# Altium project Proco RAT.PrjPcb
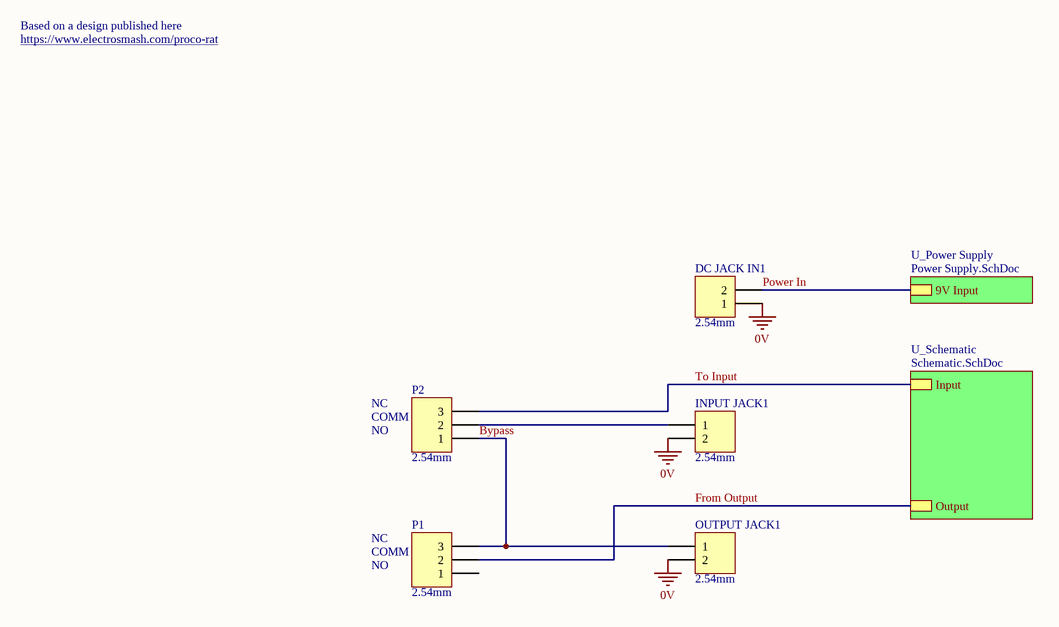
[diagram p0: Top Level.SchDoc]
2 sheets, 16 parts. Net scope: hierarchical (ports join the sheet entries above them; power ports are global).
Board file: PCB.PcbDoc
Sheets:
  Top Level.SchDoc
    U_Power Supply = Power Supply.SchDoc

## Sheet Top Level.SchDoc
size A4

### Parts
DC_JACK_IN1  2.54mm  [TH 2.54mm Header 1x2]
INPUT_JACK1  2.54mm  [TH 2.54mm Header 1x2]
OUTPUT_JACK1  2.54mm  [TH 2.54mm Header 1x2]
P1  2.54mm  [TH 2.54mm Header 1x3]
P2  2.54mm  [TH 2.54mm Header 1x3]

### Sub-sheets
U_Power Supply = Power Supply.SchDoc: 9V Input
U_Schematic = Schematic.SchDoc (file not in this document): Output, Input

### Nets
0V: DC_JACK_IN1.1 INPUT_JACK1.2 OUTPUT_JACK1.2
Bypass: OUTPUT_JACK1.1 P1.3 P2.1
From Output: P1.2 ; sheet U_Schematic/Output
Power In: DC_JACK_IN1.2 ; sheet U_Power Supply/9V Input
To Input: P2.3 ; sheet U_Schematic/Input
NetINPUT_JACK1_1: INPUT_JACK1.1 P2.2

Not connected (* = marked no-connect by the designer): P1 1

### Notes on the sheet
- https://www.electrosmash.com/proco-rat
- Based on a design published here
- NC
- COMM
- NO

### Library data of the parts
DC_JACK_IN1 INPUT_JACK1 OUTPUT_JACK1 = TH 2.54mm Header 1x2: Positions: 2; Angle: 0; Flange: No; Contact: NA; Part Number: TH 2.54mm Header 1x2; Pitch: 2.54mm; Row Spacing: 2.54mm
P1 P2 = TH 2.54mm Header 1x3: Positions: 3; Angle: 0; Flange: No; Contact: NA; Part Number: TH 2.54mm Header 1x3; Pitch: 2.54mm; Row Spacing: 2.54mm

## Sheet Power Supply.SchDoc
size A4
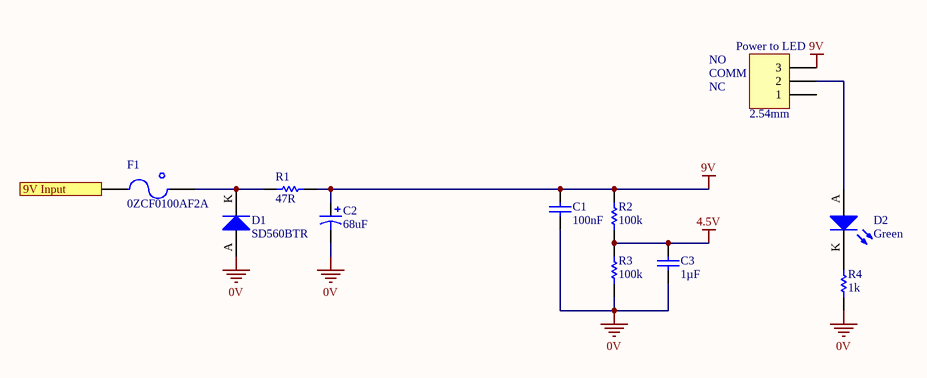
[diagram p1: Power Supply.SchDoc]

### Parts
C1  100nF  [0805]
C2  68uF  [2924]
C3  1µF  [0805]
D1  SD560BTR  [SMB Diode]
D2  Green  [5MM LED]
F1  0ZCF0100AF2A  [2920]
Power_to_LED  2.54mm  [TH 2.54mm Header 1x3]
R1  47R  [2512]
R2  100k  [0805]
R3  100k  [0805]
R4  1k  [0805]

### Ports
9V Input

### Nets
0V: C1.2 C2.1 C3.1 D1.A R3.1 R4.1
4.5V: C3.2 R2.1 R3.2
9V: C1.1 C2.2 Power_to_LED.3 R1.2 R2.2
Power In: F1.1 ; port 9V Input
NetD1_K: D1.K F1.2 R1.1
NetD2_A: D2.A Power_to_LED.2
NetD2_K: D2.K R4.2

Not connected (* = marked no-connect by the designer): Power_to_LED 1

### Notes on the sheet
- NC
- COMM
- NO

### Library data of the parts
C1 = GCM21BR71H104KA37L: Manufacturer: muRata; Tolerance: ±10%; Material: X7R; Rated Voltage: 50V; Part Number: GCM21BR71H104KA37L; Value: 100nF; Digikey Part Number: 490-6064-1-ND
C2 = TAJV686K035RNJ: Manufacturer: AVX Corporation; Tolerance: 10%; Material: Tantalum; Rated Voltage: 35V; Part Number: TAJV686K035RNJ; Value: 68uF; Digikey Part Number: 478-13135-1-ND
C3 = GCM21BR71H105KA03L: Manufacturer: muRata; Tolerance: ±10%; Material: X7R; Rated Voltage: 50V; Part Number: GCM21BR71H105KA03L; Value: 1µF; Digikey Part Number: 490-10675-1-ND
D1 = SD560BTR: 1.2V_F 600V 5A SMB; Manufacturer: SMC Diode Solutions; Part Number: SD560BTR; Digikey Part Number: 1655-1530-2-ND; Digikey Link: https://www.digikey.com/product-detail/en/smc-diode-solutions/SD560BTR/1655-1530-2-ND/6022620
D2 = C503B-GAN-CB0F0791: LED GREEN CLEAR 5MM ROUND T/H; Manufacturer: Cree Inc.; Part Number: C503B-GAN-CB0F0791; Colour: Green; Digikey Part Number: C503B-GAN-CB0F0791-ND; Digikey Link: https://www.digikey.com/products/en?mpart=C503B-GAN-CB0F0791&v=90&fbclid=IwAR2JUDlssEKQKztQKB3h34IlXIXn-Voov26K1DpWHwQ6mgzekaFZMifRLJU
F1 = 0ZCF0100AF2A: PTC RESET FUSE 60V 1A 292; Manufacturer: Littelfuse Inc.; Part Number: 0ZCF0100AF2A; Digikey Part Number: 507-2070-1-ND; Digikey Link: https://www.digikey.com/product-detail/en/bel-fuse-inc/0ZCF0100AF2A/507-2070-1-ND/6210547
Power_to_LED = TH 2.54mm Header 1x3: as P1 on sheet Top Level; Part Number: TH 2.54mm Header 1x3; Pitch: 2.54mm; Row Spacing: 2.54mm
R1 = 352147RFT: Manufacturer: TE Connectivity; Tolerance: 0.01; Rated Voltage: 2W; Part Number: 352147RFT; Value: 47R; Digikey Part Number: A116000CT-ND
R2 R3 = RC0805FR07100KL: Manufacturer: YAGEO; Tolerance: 0.01; Rated Voltage: 0.125W; Part Number: RC0805FR07100KL; Value: 100k; Material: FR-07; Digikey Part Number: 311-100KCRCT-ND
R4 = RC0805FR071KL: Manufacturer: YAGEO; Tolerance: 0.01; Rated Voltage: 0.125W; Part Number: RC0805FR071KL; Value: 1k; Material: FR-07; Digikey Part Number: 311-1.00KCRCT-ND

## Nets that join several sheets
0V: Top Level (DC_JACK_IN1.1 INPUT_JACK1.2 OUTPUT_JACK1.2), Power Supply (6 pins)
Power In: Top Level (DC_JACK_IN1.2), Power Supply (F1.1)